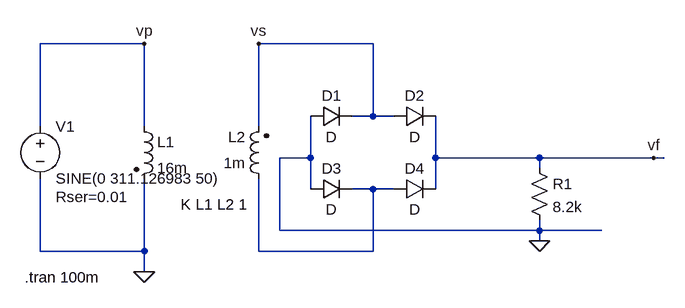
[diagram p0: schematic bridge 2.asc]
bridge 2.asc, the LTspice schematic file:
Version 4
SHEET 1 904 680
WIRE -160 -16 -320 -16
WIRE 192 -16 16 -16
WIRE 192 96 192 -16
WIRE 192 96 160 96
WIRE 224 96 192 96
WIRE -320 112 -320 -16
WIRE -160 112 -160 -16
WIRE 16 112 16 -16
WIRE 96 160 96 96
WIRE 96 160 48 160
WIRE 288 160 288 96
WIRE 448 160 288 160
WIRE 624 160 448 160
WIRE 640 160 624 160
WIRE 448 176 448 160
WIRE 96 208 96 160
WIRE 192 208 160 208
WIRE 224 208 192 208
WIRE 288 208 288 160
WIRE 48 272 48 160
WIRE 448 272 448 256
WIRE 448 272 48 272
WIRE 544 272 448 272
WIRE 448 288 448 272
WIRE -320 304 -320 192
WIRE -160 304 -160 192
WIRE -160 304 -320 304
WIRE 16 304 16 192
WIRE 192 304 192 208
WIRE 192 304 16 304
WIRE -160 336 -160 304
FLAG -160 336 0
FLAG -160 -16 vp
FLAG 16 -16 vs
FLAG 448 288 0
FLAG 624 160 vf
SYMBOL diode 96 112 R270
WINDOW 0 32 32 VTop 2
WINDOW 3 0 32 VBottom 2
SYMATTR InstName D1
SYMBOL diode 96 224 R270
WINDOW 0 32 32 VTop 2
WINDOW 3 0 32 VBottom 2
SYMATTR InstName D3
SYMBOL voltage -320 96 R0
WINDOW 123 0 0 Left 0
WINDOW 39 24 124 Left 2
SYMATTR SpiceLine Rser=0.01
SYMATTR InstName V1
SYMATTR Value SINE(0 311.126983 50)
SYMBOL diode 224 224 R270
WINDOW 0 32 32 VTop 2
WINDOW 3 0 32 VBottom 2
SYMATTR InstName D4
SYMBOL diode 224 112 R270
WINDOW 0 32 32 VTop 2
WINDOW 3 0 32 VBottom 2
SYMATTR InstName D2
SYMBOL res 432 160 R0
SYMATTR InstName R1
SYMATTR Value 8.2k
SYMBOL ind2 -176 96 R0
SYMATTR InstName L1
SYMATTR Value 16m
SYMATTR Type ind
SYMBOL ind2 32 208 R180
WINDOW 0 36 80 Left 2
WINDOW 3 36 40 Left 2
SYMATTR InstName L2
SYMATTR Value 1m
SYMATTR Type ind
TEXT -344 344 Left 2 !.tran 100m
TEXT -104 232 Left 2 !K L1 L2 1

The netlist it stands for:
* bridge 2.asc
D1 0 vs D
D3 0 N001 D
V1 vp 0 SINE(0 311.126983 50) Rser=0.01
D4 N001 vf D
D2 vs vf D
R1 vf 0 8.2k
L1 vp 0 16m
L2 N001 vs 1m
.model D D
.lib standard.dio
.tran 100m
K L1 L2 1
.backanno
.end